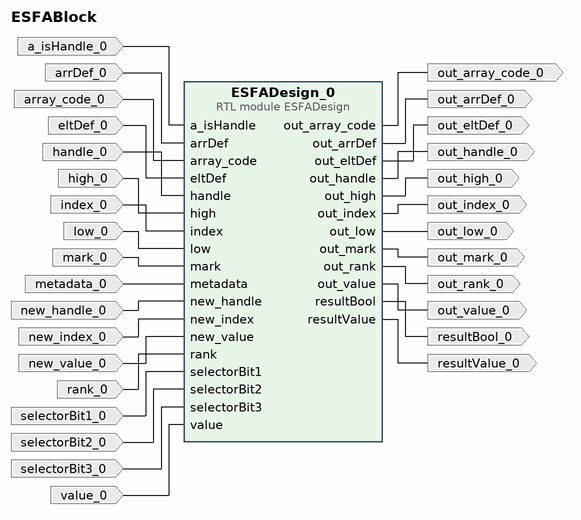
[diagram p0: block diagram of the top level]
# Vivado block design ESFABlock, xcku5p-ffvb676-2-e, Vivado 2021.1
create_bd_design ESFABlock

create_bd_port -dir I a_isHandle_0
create_bd_port -dir I arrDef_0
create_bd_port -dir I array_code_0
create_bd_port -dir I eltDef_0
create_bd_port -dir I handle_0
create_bd_port -dir I high_0
create_bd_port -dir I index_0
create_bd_port -dir I low_0
create_bd_port -dir I mark_0
create_bd_port -dir I metadata_0
create_bd_port -dir I new_handle_0
create_bd_port -dir I new_index_0
create_bd_port -dir I new_value_0
create_bd_port -dir O out_arrDef_0
create_bd_port -dir O out_array_code_0
create_bd_port -dir O out_eltDef_0
create_bd_port -dir O out_handle_0
create_bd_port -dir O out_high_0
create_bd_port -dir O out_index_0
create_bd_port -dir O out_low_0
create_bd_port -dir O out_mark_0
create_bd_port -dir O out_rank_0
create_bd_port -dir O out_value_0
create_bd_port -dir I rank_0
create_bd_port -dir O resultBool_0
create_bd_port -dir O resultValue_0
create_bd_port -dir I selectorBit1_0
create_bd_port -dir I selectorBit2_0
create_bd_port -dir I selectorBit3_0
create_bd_port -dir I value_0

create_bd_cell -type module -reference ESFADesign ESFADesign_0

# ---- connections ----

connect_bd_net [get_bd_pins ESFADesign_0/out_arrDef] [get_bd_ports out_arrDef_0]
connect_bd_net [get_bd_pins ESFADesign_0/out_array_code] [get_bd_ports out_array_code_0]
connect_bd_net [get_bd_pins ESFADesign_0/out_eltDef] [get_bd_ports out_eltDef_0]
connect_bd_net [get_bd_pins ESFADesign_0/out_handle] [get_bd_ports out_handle_0]
connect_bd_net [get_bd_pins ESFADesign_0/out_high] [get_bd_ports out_high_0]
connect_bd_net [get_bd_pins ESFADesign_0/out_index] [get_bd_ports out_index_0]
connect_bd_net [get_bd_pins ESFADesign_0/out_low] [get_bd_ports out_low_0]
connect_bd_net [get_bd_pins ESFADesign_0/out_mark] [get_bd_ports out_mark_0]
connect_bd_net [get_bd_pins ESFADesign_0/out_rank] [get_bd_ports out_rank_0]
connect_bd_net [get_bd_pins ESFADesign_0/out_value] [get_bd_ports out_value_0]
connect_bd_net [get_bd_pins ESFADesign_0/resultBool] [get_bd_ports resultBool_0]
connect_bd_net [get_bd_pins ESFADesign_0/resultValue] [get_bd_ports resultValue_0]
connect_bd_net -net a_isHandle_0_1 [get_bd_ports a_isHandle_0] [get_bd_pins ESFADesign_0/a_isHandle]
connect_bd_net -net arrDef_0_1 [get_bd_ports arrDef_0] [get_bd_pins ESFADesign_0/arrDef]
connect_bd_net -net array_code_0_1 [get_bd_ports array_code_0] [get_bd_pins ESFADesign_0/array_code]
connect_bd_net -net eltDef_0_1 [get_bd_ports eltDef_0] [get_bd_pins ESFADesign_0/eltDef]
connect_bd_net -net handle_0_1 [get_bd_ports handle_0] [get_bd_pins ESFADesign_0/handle]
connect_bd_net -net high_0_1 [get_bd_ports high_0] [get_bd_pins ESFADesign_0/high]
connect_bd_net -net index_0_1 [get_bd_ports index_0] [get_bd_pins ESFADesign_0/index]
connect_bd_net -net low_0_1 [get_bd_ports low_0] [get_bd_pins ESFADesign_0/low]
connect_bd_net -net mark_0_1 [get_bd_ports mark_0] [get_bd_pins ESFADesign_0/mark]
connect_bd_net -net metadata_0_1 [get_bd_ports metadata_0] [get_bd_pins ESFADesign_0/metadata]
connect_bd_net -net new_handle_0_1 [get_bd_ports new_handle_0] [get_bd_pins ESFADesign_0/new_handle]
connect_bd_net -net new_index_0_1 [get_bd_ports new_index_0] [get_bd_pins ESFADesign_0/new_index]
connect_bd_net -net new_value_0_1 [get_bd_ports new_value_0] [get_bd_pins ESFADesign_0/new_value]
connect_bd_net -net rank_0_1 [get_bd_ports rank_0] [get_bd_pins ESFADesign_0/rank]
connect_bd_net -net selectorBit1_0_1 [get_bd_ports selectorBit1_0] [get_bd_pins ESFADesign_0/selectorBit1]
connect_bd_net -net selectorBit2_0_1 [get_bd_ports selectorBit2_0] [get_bd_pins ESFADesign_0/selectorBit2]
connect_bd_net -net selectorBit3_0_1 [get_bd_ports selectorBit3_0] [get_bd_pins ESFADesign_0/selectorBit3]
connect_bd_net -net value_0_1 [get_bd_ports value_0] [get_bd_pins ESFADesign_0/value]

validate_bd_design
save_bd_design
